# EasyEDA schematic SCH_TeenyModXO.json
TITLE: Sheet_1; REV: 1.0; Date: 2024-11-05; Sheet: 1/1; Company: Your Company
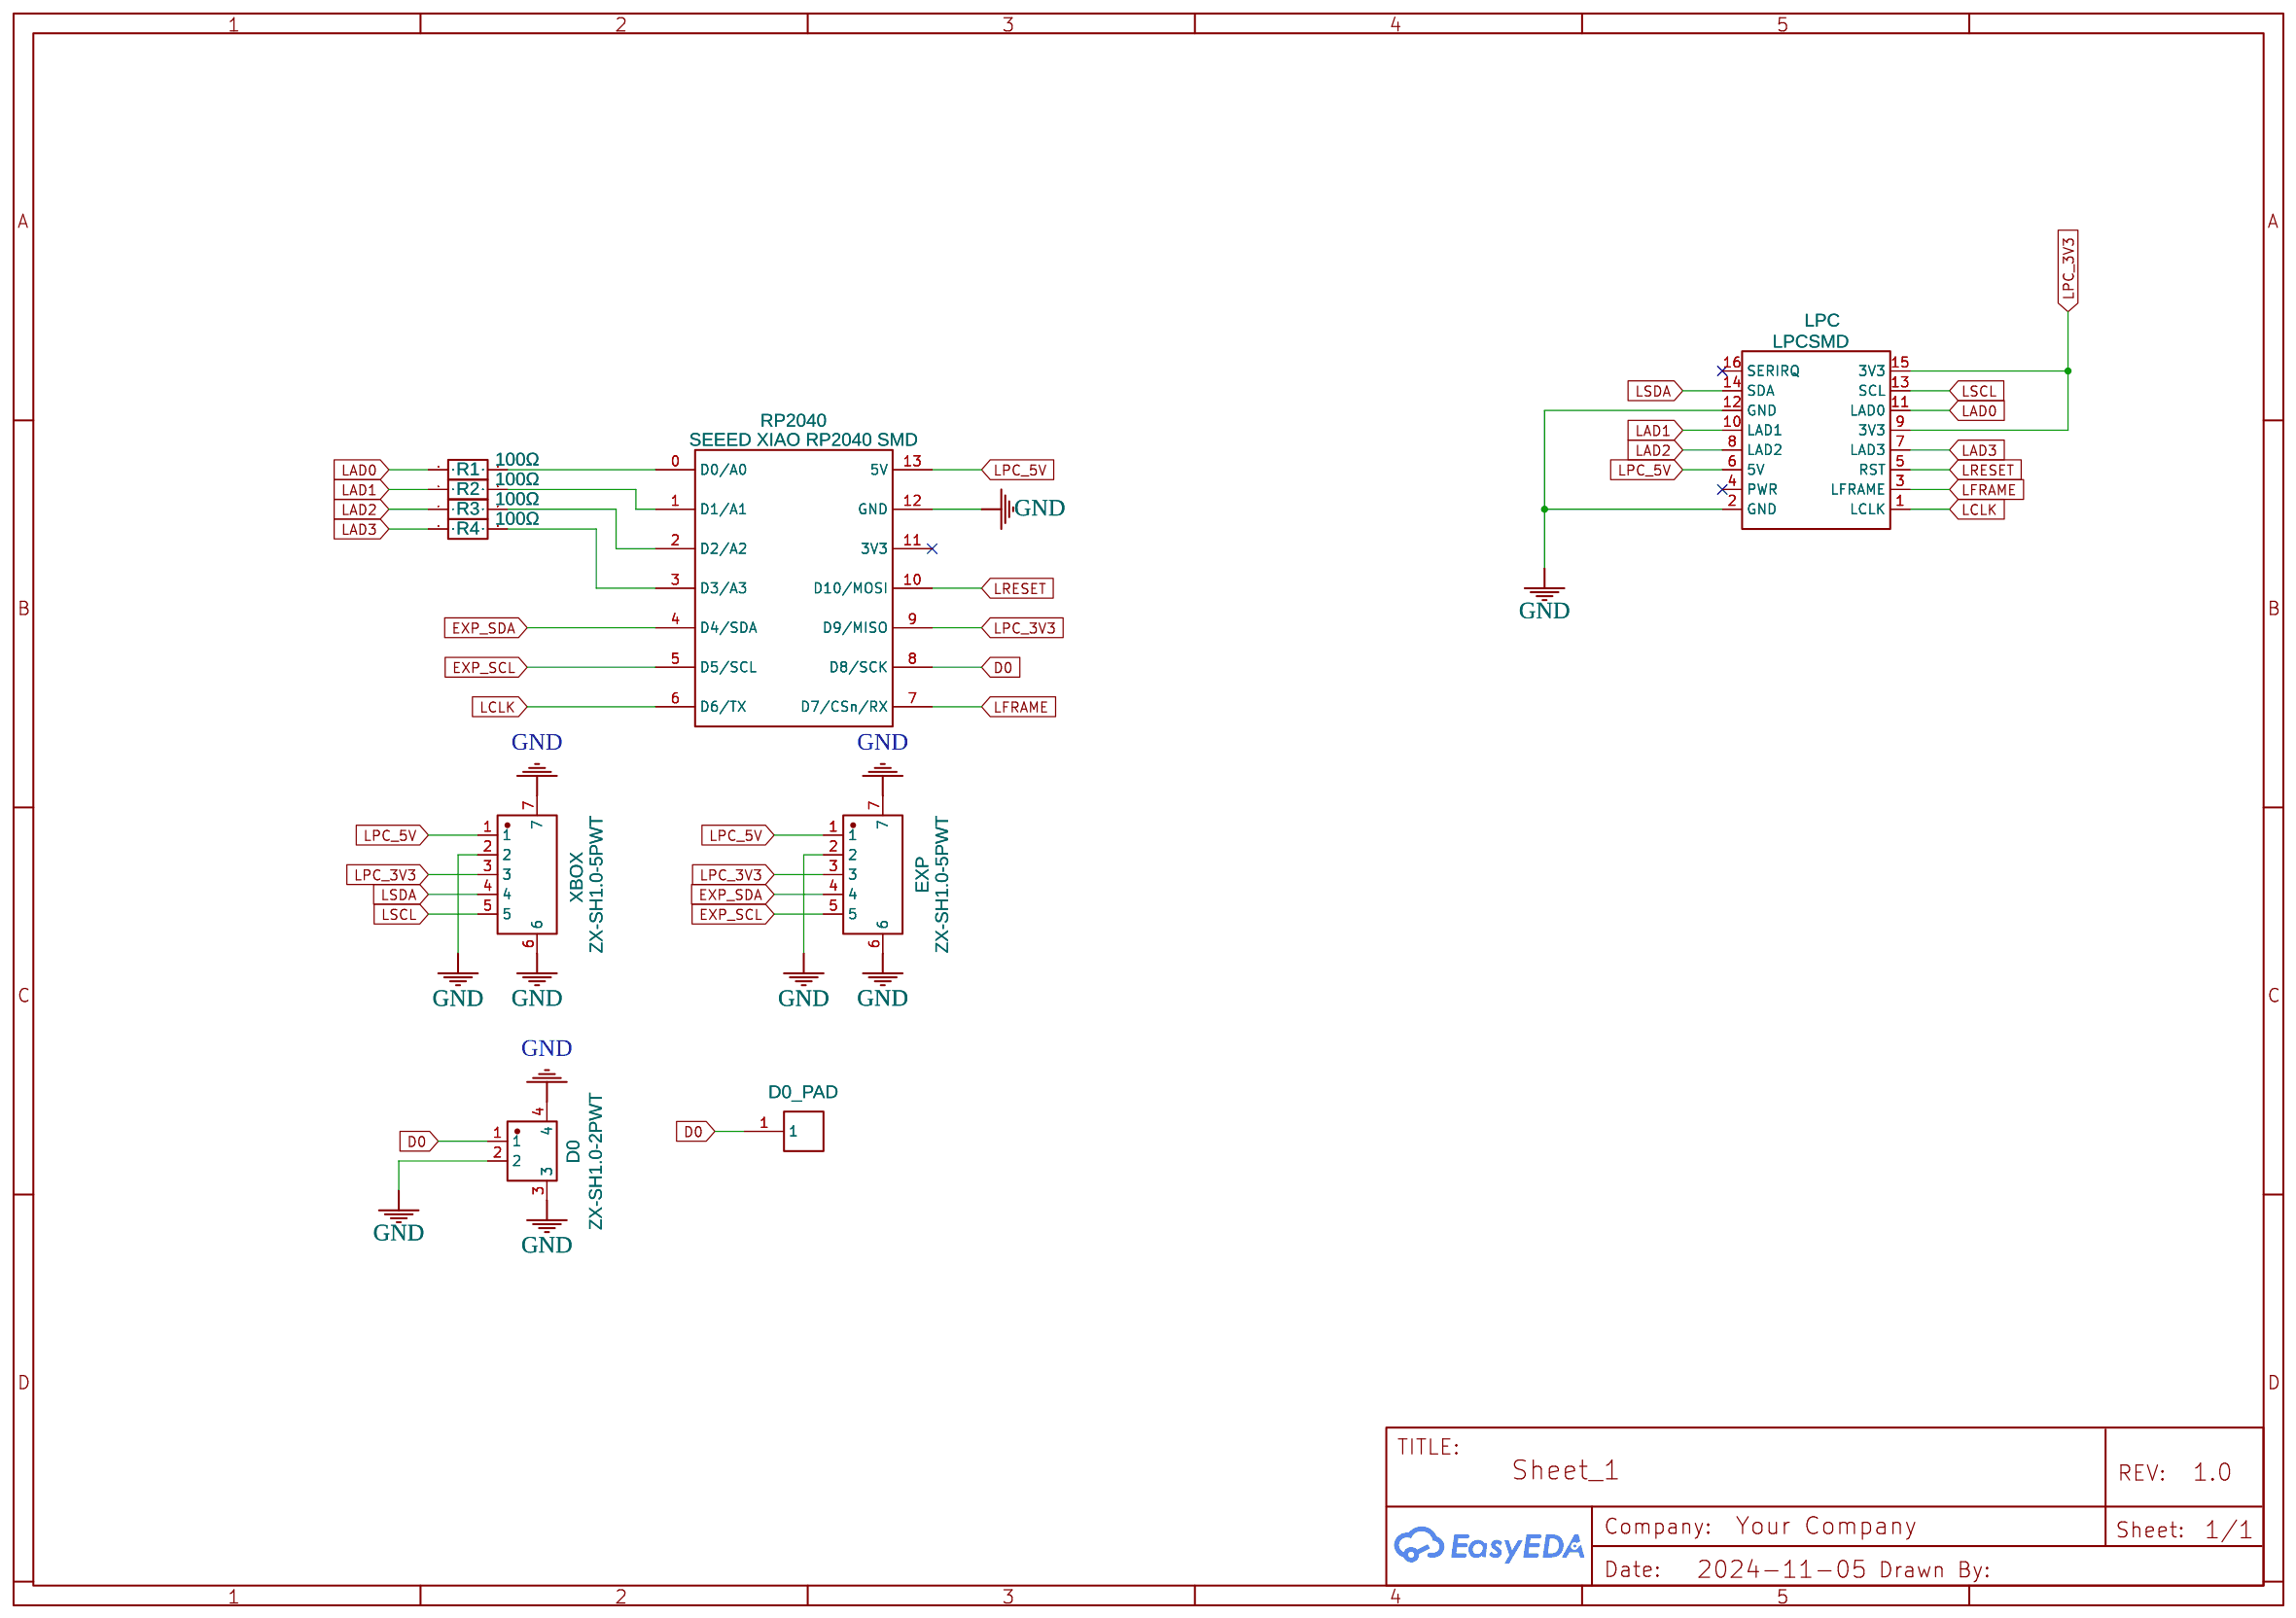
[diagram p0: schematic sheet]

## Parts
D0  ZX-SH1.0-2PWT  [CONN-SMD_2P-P1.00_HX-1.0-2P-WT]
D0_PAD  Solderpad 4x2  [SOLDERPAD4X2]
EXP  ZX-SH1.0-5PWT  [CONN-SMD_5P-P1.00_MEGASTAR_ZX-SH1.0-5PWT]
LPC  LPCSMD  [LPCSMD]
R1  100Ω  [R0603]
R2  100Ω  [R0603]
R3  100Ω  [R0603]
R4  100Ω  [R0603]
RP2040  SEEED XIAO RP2040 SMD  [XIAO RP2040 SMD]
XBOX  ZX-SH1.0-5PWT  [CONN-SMD_5P-P1.00_MEGASTAR_ZX-SH1.0-5PWT]

## Library data of the parts
D0 = ZX-SH1.0-2PWT: Supplier: LCSC; Supplier Part: C7430444; Manufacturer: Megastar(兆星); JLCPCB Part Class: Extended Part; Contributor: lcsc
D0_PAD = Solderpad 4x2: Contributor: michael_fluck
EXP XBOX = ZX-SH1.0-5PWT: Contributor: lcsc; Supplier: LCSC; Supplier Part: C7430447; Manufacturer: Megastar(兆星); JLCPCB Part Class: Extended Part
LPC = LPCSMD: Supplier: LCSC; Supplier Part: C22436156; Manufacturer: HC(虹成电子); Manufacturer Part: HC-PM254-8.5H-2x8PS; Contributor: Peter Tribe; JLCPCB Part Class: Extended Part
R1-R4 = CRCW0603100RJNEA: Contributor: LCSC; Supplier: LCSC; Supplier Part: C844726; Manufacturer: VISHAY(威世); JLCPCB Part Class: Extended Part
RP2040 = SEEED XIAO RP2040 SMD: Supplier Part: 713-102010428; Supplier: Mouser; link: https://no.mouser.com/ProductDetail/Seeed-Studio/102010428?qs=Znm5pLBrcAJ75FCbdxzDHQ%3D%3D; Contributor: jonah vandenbrandt

## Nets
GND: D0.2 D0.3 D0.4 EXP.2 EXP.6 EXP.7 LPC.2(GND) LPC.12(GND) RP2040.12(GND) XBOX.2 XBOX.6 XBOX.7
D0: D0.1 D0_PAD.1 RP2040.8(D8/SCK)
EXP_SCL: EXP.5 RP2040.5(D5/SCL)
EXP_SDA: EXP.4 RP2040.4(D4/SDA)
LAD0: LPC.11(LAD0) R1.1
LAD1: LPC.10(LAD1) R2.1
LAD2: LPC.8(LAD2) R3.1
LAD3: LPC.7(LAD3) R4.1
LCLK: LPC.1(LCLK) RP2040.6(D6/TX)
LFRAME: LPC.3(LFRAME) RP2040.7(D7/CSn/RX)
LPC_3V3: EXP.3 LPC.9(3V3) LPC.15(3V3) RP2040.9(D9/MISO) XBOX.3
LPC_5V: EXP.1 LPC.6(5V) RP2040.13(5V) XBOX.1
LRESET: LPC.5(RST) RP2040.10(D10/MOSI)
LSCL: LPC.13(SCL) XBOX.5
LSDA: LPC.14(SDA) XBOX.4
Net-(R1-2): R1.2 RP2040.0(D0/A0)
Net-(R2-2): R2.2 RP2040.1(D1/A1)
Net-(R3-2): R3.2 RP2040.2(D2/A2)
Net-(R4-2): R4.2 RP2040.3(D3/A3)

Not connected (* = marked no-connect by the designer): LPC 4(PWR)* 16(SERIRQ)*; RP2040 11(3V3)*
